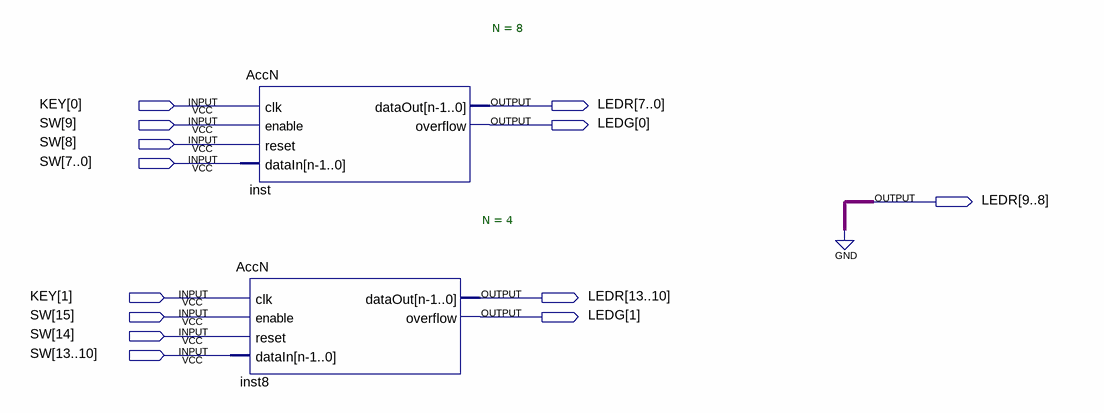
[diagram p0: schematic sheet]
// Quartus schematic AccN_Demo.bdf as structural Verilog: 2 symbols, 13 pins
module AccN_Demo (
  input  [1:0] KEY,
  input  [15:0] SW,
  output [13:0] LEDR,
  output [1:0] LEDG
);

  AccN #(.N(8)) inst (
    .clk(KEY[0]), .enable(SW[9]), .reset(SW[8]), .dataIn(SW[7:0]), .dataOut(LEDR[7:0]), .overflow(LEDG[0]));
  AccN #(.N(4)) inst8 (
    .clk(KEY[1]), .enable(SW[15]), .reset(SW[14]), .dataIn(SW[13:10]), .dataOut(LEDR[13:10]),
    .overflow(LEDG[1]));

  assign LEDR[9:8] = 2'b00;
endmodule
